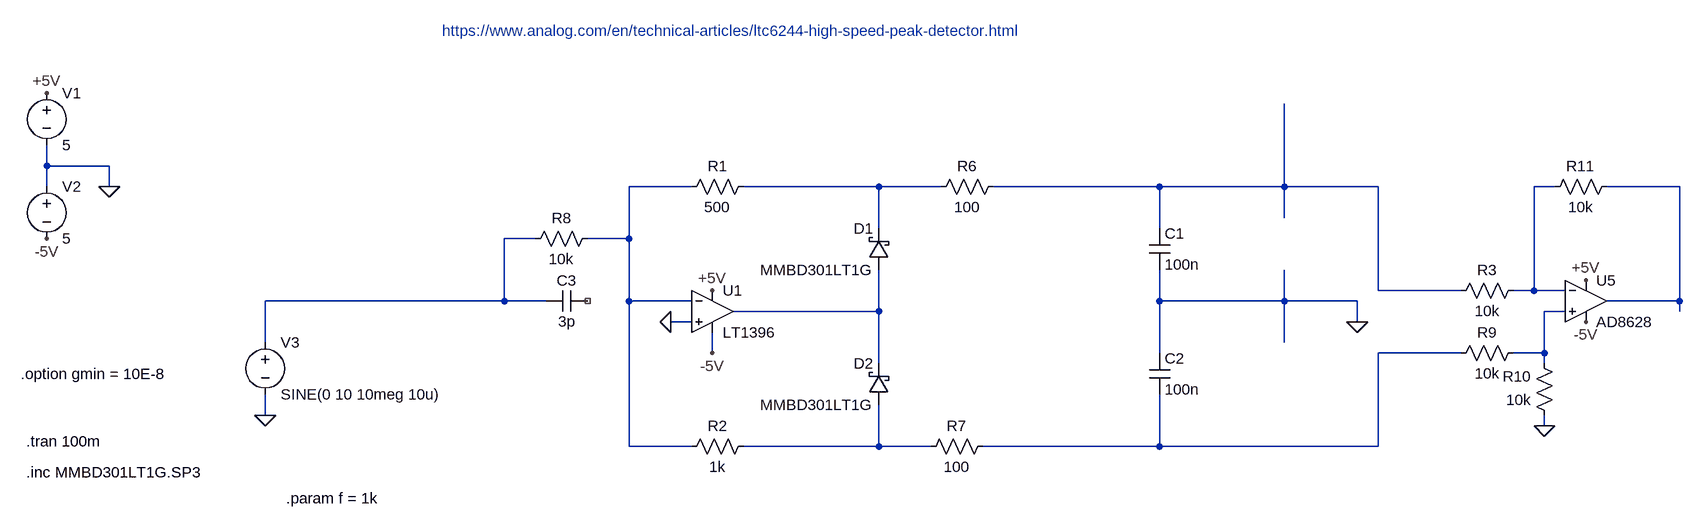
[diagram p0: schematic RF-Detector.asc]
RF-Detector.asc, the LTspice schematic file:
Version 4
SHEET 1 2928 2292
WIRE -512 240 -512 208
WIRE -416 240 -512 240
WIRE -512 272 -512 240
WIRE -416 272 -416 240
WIRE 480 272 384 272
WIRE 768 272 560 272
WIRE 864 272 768 272
WIRE 1200 272 944 272
WIRE 1392 272 1392 144
WIRE 1392 272 1200 272
WIRE 1536 272 1392 272
WIRE 1808 272 1776 272
WIRE 2000 272 1888 272
WIRE 1392 320 1392 272
WIRE 768 336 768 272
WIRE 1200 336 1200 272
WIRE 240 352 192 352
WIRE 384 352 384 272
WIRE 384 352 320 352
WIRE 1536 432 1536 272
WIRE 1664 432 1536 432
WIRE 1776 432 1776 272
WIRE 1776 432 1744 432
WIRE 1824 432 1776 432
WIRE 192 448 192 352
WIRE 192 448 -176 448
WIRE 256 448 192 448
WIRE 384 448 384 352
WIRE 480 448 384 448
WIRE 1200 448 1200 400
WIRE 1392 448 1392 400
WIRE 1392 448 1200 448
WIRE 1504 448 1392 448
WIRE 2000 448 2000 272
WIRE 2000 448 1888 448
WIRE 768 464 768 400
WIRE 768 464 544 464
WIRE 1824 464 1792 464
WIRE 2000 464 2000 448
WIRE 480 480 448 480
WIRE 1504 480 1504 448
WIRE -176 512 -176 448
WIRE 1392 512 1392 448
WIRE 512 528 512 496
WIRE 1200 528 1200 448
WIRE 1664 528 1536 528
WIRE 1792 528 1792 464
WIRE 1792 528 1744 528
WIRE 768 544 768 464
WIRE 1792 544 1792 528
WIRE -176 624 -176 592
WIRE 1792 640 1792 624
WIRE 384 672 384 448
WIRE 480 672 384 672
WIRE 768 672 768 608
WIRE 768 672 560 672
WIRE 848 672 768 672
WIRE 1200 672 1200 592
WIRE 1200 672 928 672
WIRE 1536 672 1536 528
WIRE 1536 672 1200 672
FLAG -416 272 0
FLAG -512 128 +5V
FLAG -512 352 -5V
FLAG 448 480 0
FLAG 512 528 -5V
FLAG 512 432 +5V
FLAG -176 624 0
FLAG 1504 480 0
FLAG 1856 480 -5V
FLAG 1856 416 +5V
FLAG 1792 640 0
SYMBOL voltage -512 112 R0
WINDOW 123 0 0 Left 0
WINDOW 39 0 0 Left 0
SYMATTR InstName V1
SYMATTR Value 5
SYMBOL voltage -512 256 R0
WINDOW 123 0 0 Left 0
WINDOW 39 0 0 Left 0
SYMATTR InstName V2
SYMATTR Value 5
SYMBOL schottky 784 608 R180
WINDOW 0 24 64 Left 2
WINDOW 3 24 0 Left 2
SYMATTR InstName D2
SYMATTR Value MMBD301LT1G
SYMATTR Description Diode
SYMATTR Type diode
SYMBOL res 576 256 R90
WINDOW 0 0 56 VBottom 2
WINDOW 3 32 56 VTop 2
SYMATTR InstName R1
SYMATTR Value 500
SYMBOL res 576 656 R90
WINDOW 0 0 56 VBottom 2
WINDOW 3 32 56 VTop 2
SYMATTR InstName R2
SYMATTR Value 1k
SYMBOL schottky 784 400 R180
WINDOW 0 24 64 Left 2
WINDOW 3 24 0 Left 2
SYMATTR InstName D1
SYMATTR Value MMBD301LT1G
SYMATTR Description Diode
SYMATTR Type diode
SYMBOL res 960 256 R90
WINDOW 0 0 56 VBottom 2
WINDOW 3 32 56 VTop 2
SYMATTR InstName R6
SYMATTR Value 100
SYMBOL res 944 656 R90
WINDOW 0 0 56 VBottom 2
WINDOW 3 32 56 VTop 2
SYMATTR InstName R7
SYMATTR Value 100
SYMBOL Opamps\\LT1396 512 400 R0
SYMATTR InstName U1
SYMBOL cap 1184 336 R0
SYMATTR InstName C1
SYMATTR Value 100n
SYMBOL cap 1184 528 R0
SYMATTR InstName C2
SYMATTR Value 100n
SYMBOL cap 320 432 R90
WINDOW 0 0 32 VBottom 2
WINDOW 3 32 32 VTop 2
SYMATTR InstName C3
SYMATTR Value 3p
SYMBOL res 336 336 R90
WINDOW 0 0 56 VBottom 2
WINDOW 3 32 56 VTop 2
SYMATTR InstName R8
SYMATTR Value 10k
SYMBOL voltage -176 496 R0
WINDOW 123 0 0 Left 0
WINDOW 39 0 0 Left 0
SYMATTR InstName V3
SYMATTR Value SINE(0 10 10meg 10u)
SYMBOL Opamps\\AD8628 1856 384 R0
SYMATTR InstName U5
SYMBOL res 1760 416 R90
WINDOW 0 0 56 VBottom 2
WINDOW 3 32 56 VTop 2
SYMATTR InstName R3
SYMATTR Value 10k
SYMBOL res 1760 512 R90
WINDOW 0 0 56 VBottom 2
WINDOW 3 32 56 VTop 2
SYMATTR InstName R9
SYMATTR Value 10k
SYMBOL res 1808 640 R180
WINDOW 0 36 76 Left 2
WINDOW 3 36 40 Left 2
SYMATTR InstName R10
SYMATTR Value 10k
SYMBOL res 1792 288 R270
WINDOW 0 32 56 VTop 2
WINDOW 3 0 56 VBottom 2
SYMATTR InstName R11
SYMATTR Value 10k
TEXT 96 32 Left 2 ;https://www.analog.com/en/technical-articles/ltc6244-high-speed-peak-detector.html
TEXT -544 664 Left 2 !.tran 100m
TEXT -544 712 Left 2 !.inc MMBD301LT1G.SP3
TEXT -144 752 Left 2 !.param f = 1k
TEXT -552 560 Left 2 !.option gmin = 10E-8

The netlist it stands for:
* RF-Detector.asc
V1 +5V 0 5
V2 0 -5V 5
D2 N010 N007 MMBD301LT1G
R1 N002 N001 500
R2 N010 N001 1k
D1 N007 N002 MMBD301LT1G
R6 N003 N002 100
R7 N009 N010 100
XU1 0 N001 +5V -5V N007 LT1396  ; pins In+ In- V+ V- OUT
C1 N003 0 100n
C2 0 N009 100n
C3 NC_01 N006 3p
R8 N001 N006 10k
V3 N006 0 SINE(0 10 10meg 10u)
XU5 N008 N004 +5V -5V N005 AD8628  ; pins In+ In- V+ V- OUT
R3 N004 N003 10k
R9 N008 N009 10k
R10 0 N008 10k
R11 N004 N005 10k
.model D D
.lib standard.dio
* https://www.analog.com/en/technical-articles/ltc6244-high-speed-peak-detector.html
.tran 100m
.inc MMBD301LT1G.SP3
.param f = 1k
.option gmin = 10E-8
.backanno
.end